# Altium project NEXUS_tapeout_connector.PrjPcb
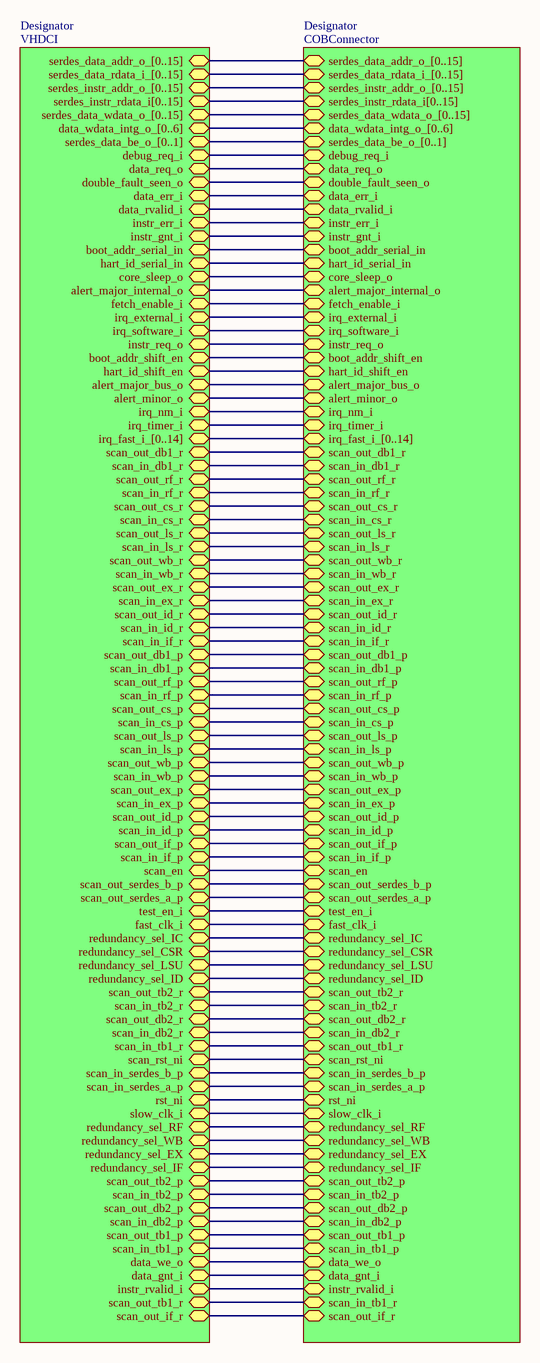
[diagram p0: Main.SchDoc]
3 sheets, 14 parts. Net scope: hierarchical (ports join the sheet entries above them; power ports are global).
Board file: PCB1.PcbDoc
Sheets:
  Main.SchDoc
    Designator = VHDCI.SchDoc
    Designator = COBConnector.SchDoc

## Sheet Main.SchDoc
size B portrait; SheetNumber: 1; SheetTotal: 3

### Sub-sheets
Designator = VHDCI: serdes_data_addr_o_[0..15] (bidir), serdes_data_rdata_i_[0..15] (bidir), serdes_instr_addr_o_[0..15] (bidir), serdes_instr_rdata_i[0..15] (bidir), serdes_data_wdata_o_[0..15] (bidir), data_wdata_intg_o_[0..6] (bidir), serdes_data_be_o_[0..1] (bidir), data_req_o (bidir), double_fault_seen_o (bidir), data_err_i (bidir), data_rvalid_i (bidir), instr_err_i (bidir), instr_gnt_i (bidir), boot_addr_serial_in (bidir), hart_id_serial_in (bidir), core_sleep_o (bidir), alert_major_internal_o (bidir), fetch_enable_i (bidir), irq_external_i (bidir), irq_software_i (bidir), instr_req_o (bidir), boot_addr_shift_en (bidir), hart_id_shift_en (bidir), alert_major_bus_o (bidir), alert_minor_o (bidir), irq_nm_i (bidir), irq_timer_i (bidir), irq_fast_i_[0..14] (bidir), scan_out_db1_r (bidir), scan_in_db1_r (bidir), scan_out_rf_r (bidir), scan_in_rf_r (bidir), scan_out_cs_r (bidir), scan_in_cs_r (bidir), scan_out_ls_r (bidir), scan_in_ls_r (bidir), scan_out_wb_r (bidir), scan_in_wb_r (bidir), scan_out_ex_r (bidir), scan_in_ex_r (bidir), scan_out_id_r (bidir), scan_in_id_r (bidir), scan_out_if_r (bidir), scan_in_if_r (bidir), scan_out_db1_p (bidir), scan_in_db1_p (bidir), scan_out_rf_p (bidir), scan_in_rf_p (bidir), scan_out_cs_p (bidir), scan_in_cs_p (bidir), scan_out_ls_p (bidir), scan_in_ls_p (bidir), scan_out_wb_p (bidir), scan_in_wb_p (bidir), scan_out_ex_p (bidir), scan_in_ex_p (bidir), scan_out_id_p (bidir), scan_in_id_p (bidir), scan_out_if_p (bidir), scan_in_if_p (bidir), scan_en (bidir), scan_out_serdes_b_p (bidir), scan_out_serdes_a_p (bidir), test_en_i (bidir), fast_clk_i (bidir), redundancy_sel_IC (bidir), redundancy_sel_CSR (bidir), redundancy_sel_LSU (bidir), redundancy_sel_ID (bidir), scan_out_tb2_r (bidir), scan_in_tb2_r (bidir), scan_out_db2_r (bidir), scan_in_db2_r (bidir), scan_in_tb1_r (bidir), scan_rst_ni (bidir), scan_in_serdes_b_p (bidir), scan_in_serdes_a_p (bidir), rst_ni (bidir), slow_clk_i (bidir), redundancy_sel_RF (bidir), redundancy_sel_WB (bidir), redundancy_sel_EX (bidir), redundancy_sel_IF (bidir), scan_out_tb2_p (bidir), scan_in_tb2_p (bidir), scan_out_db2_p (bidir), scan_in_db2_p (bidir), scan_out_tb1_p (bidir), scan_in_tb1_p (bidir), debug_req_i (bidir), data_we_o (bidir), data_gnt_i (bidir), instr_rvalid_i (bidir), scan_out_tb1_r (bidir)
Designator = COBConnector: serdes_data_addr_o_[0..15] (bidir), serdes_data_rdata_i_[0..15] (bidir), serdes_instr_addr_o_[0..15] (bidir), serdes_data_wdata_o_[0..15] (bidir), data_wdata_intg_o_[0..6] (bidir), serdes_data_be_o_[0..1] (bidir), debug_req_i (bidir), data_req_o (bidir), double_fault_seen_o (bidir), data_err_i (bidir), data_rvalid_i (bidir), data_we_o (bidir), data_gnt_i (bidir), instr_err_i (bidir), instr_gnt_i (bidir), boot_addr_serial_in (bidir), hart_id_serial_in (bidir), core_sleep_o (bidir), alert_major_internal_o (bidir), fetch_enable_i (bidir), irq_external_i (bidir), irq_software_i (bidir), instr_req_o (bidir), boot_addr_shift_en (bidir), hart_id_shift_en (bidir), alert_major_bus_o (bidir), alert_minor_o (bidir), irq_nm_i (bidir), irq_timer_i (bidir), irq_fast_i_[0..14] (bidir), scan_out_db1_r (bidir), scan_in_db1_r (bidir), scan_out_rf_r (bidir), scan_in_rf_r (bidir), scan_out_cs_r (bidir), scan_in_cs_r (bidir), scan_out_ls_r (bidir), scan_in_ls_r (bidir), scan_out_wb_r (bidir), scan_in_wb_r (bidir), scan_out_ex_r (bidir), scan_in_ex_r (bidir), scan_out_id_r (bidir), scan_out_if_r (bidir), scan_in_if_r (bidir), scan_out_db1_p (bidir), scan_in_db1_p (bidir), scan_out_rf_p (bidir), scan_in_rf_p (bidir), scan_out_cs_p (bidir), scan_in_cs_p (bidir), scan_out_ls_p (bidir), scan_in_ls_p (bidir), scan_out_wb_p (bidir), scan_in_wb_p (bidir), scan_out_ex_p (bidir), scan_in_ex_p (bidir), scan_out_id_p (bidir), scan_in_id_p (bidir), scan_out_if_p (bidir), scan_in_if_p (bidir), scan_en (bidir), scan_out_serdes_b_p (bidir), scan_out_serdes_a_p (bidir), test_en_i (bidir), fast_clk_i (bidir), redundancy_sel_IC (bidir), redundancy_sel_CSR (bidir), redundancy_sel_LSU (bidir), redundancy_sel_ID (bidir), scan_out_tb2_r (bidir), scan_in_tb2_r (bidir), scan_out_db2_r (bidir), scan_in_db2_r (bidir), scan_out_tb1_r (bidir), scan_rst_ni (bidir), scan_in_serdes_b_p (bidir), scan_in_serdes_a_p (bidir), rst_ni (bidir), slow_clk_i (bidir), redundancy_sel_RF (bidir), redundancy_sel_WB (bidir), redundancy_sel_EX (bidir), redundancy_sel_IF (bidir), scan_out_tb2_p (bidir), scan_in_tb2_p (bidir), scan_out_db2_p (bidir), scan_in_db2_p (bidir), scan_out_tb1_p (bidir), scan_in_tb1_p (bidir), scan_in_id_r (bidir), serdes_instr_rdata_i[0..15] (bidir), instr_rvalid_i (bidir), scan_in_tb1_r (bidir)

### Nets
alert_major_bus_o: sheet Designator/alert_major_bus_o, sheet Designator/alert_major_bus_o
alert_major_internal_o: sheet Designator/alert_major_internal_o, sheet Designator/alert_major_internal_o
alert_minor_o: sheet Designator/alert_minor_o, sheet Designator/alert_minor_o
boot_addr_serial_in: sheet Designator/boot_addr_serial_in, sheet Designator/boot_addr_serial_in
boot_addr_shift_en: sheet Designator/boot_addr_shift_en, sheet Designator/boot_addr_shift_en
core_sleep_o: sheet Designator/core_sleep_o, sheet Designator/core_sleep_o
data_err_i: sheet Designator/data_err_i, sheet Designator/data_err_i
data_gnt_i: sheet Designator/data_gnt_i, sheet Designator/data_gnt_i
data_req_o: sheet Designator/data_req_o, sheet Designator/data_req_o
data_rvalid_i: sheet Designator/data_rvalid_i, sheet Designator/data_rvalid_i
data_we_o: sheet Designator/data_we_o, sheet Designator/data_we_o
debug_req_i: sheet Designator/debug_req_i, sheet Designator/debug_req_i
double_fault_seen_o: sheet Designator/double_fault_seen_o, sheet Designator/double_fault_seen_o
fast_clk_i: sheet Designator/fast_clk_i, sheet Designator/fast_clk_i
fetch_enable_i: sheet Designator/fetch_enable_i, sheet Designator/fetch_enable_i
hard_id_serial_in: sheet Designator/hart_id_serial_in, sheet Designator/hart_id_serial_in
hard_id_shift_en: sheet Designator/hart_id_shift_en, sheet Designator/hart_id_shift_en
instr_err_i: sheet Designator/instr_err_i, sheet Designator/instr_err_i
instr_gnt_i: sheet Designator/instr_gnt_i, sheet Designator/instr_gnt_i
instr_req_o: sheet Designator/instr_req_o, sheet Designator/instr_req_o
instr_rvalid_i: sheet Designator/instr_rvalid_i, sheet Designator/instr_rvalid_i
irq_external_i: sheet Designator/irq_external_i, sheet Designator/irq_external_i
irq_nm_i: sheet Designator/irq_nm_i, sheet Designator/irq_nm_i
irq_software_i: sheet Designator/irq_software_i, sheet Designator/irq_software_i
irq_timer_i: sheet Designator/irq_timer_i, sheet Designator/irq_timer_i
redundancy_sel_CSR: sheet Designator/redundancy_sel_CSR, sheet Designator/redundancy_sel_CSR
redundancy_sel_EX: sheet Designator/redundancy_sel_EX, sheet Designator/redundancy_sel_EX
redundancy_sel_IC: sheet Designator/redundancy_sel_IC, sheet Designator/redundancy_sel_IC
redundancy_sel_ID: sheet Designator/redundancy_sel_ID, sheet Designator/redundancy_sel_ID
redundancy_sel_IF: sheet Designator/redundancy_sel_IF, sheet Designator/redundancy_sel_IF
redundancy_sel_LSU: sheet Designator/redundancy_sel_LSU, sheet Designator/redundancy_sel_LSU
redundancy_sel_RF: sheet Designator/redundancy_sel_RF, sheet Designator/redundancy_sel_RF
redundancy_sel_WB: sheet Designator/redundancy_sel_WB, sheet Designator/redundancy_sel_WB
rst_ni: sheet Designator/rst_ni, sheet Designator/rst_ni
scan_en: sheet Designator/scan_en, sheet Designator/scan_en
scan_in_cs_p: sheet Designator/scan_in_cs_p, sheet Designator/scan_in_cs_p
scan_in_cs_r: sheet Designator/scan_in_cs_r, sheet Designator/scan_in_cs_r
scan_in_db1_p: sheet Designator/scan_in_db1_p, sheet Designator/scan_in_db1_p
scan_in_db1_r: sheet Designator/scan_in_db1_r, sheet Designator/scan_in_db1_r
scan_in_db2_p: sheet Designator/scan_in_db2_p, sheet Designator/scan_in_db2_p
scan_in_db2_r: sheet Designator/scan_in_db2_r, sheet Designator/scan_in_db2_r
scan_in_ex_p: sheet Designator/scan_in_ex_p, sheet Designator/scan_in_ex_p
scan_in_ex_r: sheet Designator/scan_in_ex_r, sheet Designator/scan_in_ex_r
scan_in_id_p: sheet Designator/scan_in_id_p, sheet Designator/scan_in_id_p
scan_in_id_r: sheet Designator/scan_in_id_r, sheet Designator/scan_in_id_r
scan_in_if_p: sheet Designator/scan_in_if_p, sheet Designator/scan_in_if_p
scan_in_if_r: sheet Designator/scan_in_if_r, sheet Designator/scan_in_if_r
scan_in_ls_p: sheet Designator/scan_in_ls_p, sheet Designator/scan_in_ls_p
scan_in_ls_r: sheet Designator/scan_in_ls_r, sheet Designator/scan_in_ls_r
scan_in_rf_p: sheet Designator/scan_in_rf_p, sheet Designator/scan_in_rf_p
scan_in_rf_r: sheet Designator/scan_in_rf_r, sheet Designator/scan_in_rf_r
scan_in_serdes_a_p: sheet Designator/scan_in_serdes_a_p, sheet Designator/scan_in_serdes_a_p
scan_in_serdes_b_p: sheet Designator/scan_in_serdes_b_p, sheet Designator/scan_in_serdes_b_p
scan_in_tb1_p: sheet Designator/scan_in_tb1_p, sheet Designator/scan_in_tb1_p
scan_in_tb1_r: sheet Designator/scan_out_tb1_r, sheet Designator/scan_in_tb1_r
scan_in_tb1_r: sheet Designator/scan_in_tb1_r, sheet Designator/scan_out_tb1_r  [a separate net that carries the same name]
scan_in_tb2_p: sheet Designator/scan_in_tb2_p, sheet Designator/scan_in_tb2_p
scan_in_tb2_r: sheet Designator/scan_in_tb2_r, sheet Designator/scan_in_tb2_r
scan_in_wb_p: sheet Designator/scan_in_wb_p, sheet Designator/scan_in_wb_p
scan_in_wb_r: sheet Designator/scan_in_wb_r, sheet Designator/scan_in_wb_r
scan_out_cs_p: sheet Designator/scan_out_cs_p, sheet Designator/scan_out_cs_p
scan_out_cs_r: sheet Designator/scan_out_cs_r, sheet Designator/scan_out_cs_r
scan_out_db1_p: sheet Designator/scan_out_db1_p, sheet Designator/scan_out_db1_p
scan_out_db1_r: sheet Designator/scan_out_db1_r, sheet Designator/scan_out_db1_r
scan_out_db2_p: sheet Designator/scan_out_db2_p, sheet Designator/scan_out_db2_p
scan_out_db2_r: sheet Designator/scan_out_db2_r, sheet Designator/scan_out_db2_r
scan_out_ex_p: sheet Designator/scan_out_ex_p, sheet Designator/scan_out_ex_p
scan_out_ex_r: sheet Designator/scan_out_ex_r, sheet Designator/scan_out_ex_r
scan_out_id_p: sheet Designator/scan_out_id_p, sheet Designator/scan_out_id_p
scan_out_id_r: sheet Designator/scan_out_id_r, sheet Designator/scan_out_id_r
scan_out_if_p: sheet Designator/scan_out_if_p, sheet Designator/scan_out_if_p
scan_out_if_r: sheet Designator/scan_out_if_r, sheet Designator/scan_out_if_r
scan_out_ls_p: sheet Designator/scan_out_ls_p, sheet Designator/scan_out_ls_p
scan_out_ls_r: sheet Designator/scan_out_ls_r, sheet Designator/scan_out_ls_r
scan_out_rf_p: sheet Designator/scan_out_rf_p, sheet Designator/scan_out_rf_p
scan_out_rf_r: sheet Designator/scan_out_rf_r, sheet Designator/scan_out_rf_r
scan_out_serdes_a_p: sheet Designator/scan_out_serdes_a_p, sheet Designator/scan_out_serdes_a_p
scan_out_serdes_b_p: sheet Designator/scan_out_serdes_b_p, sheet Designator/scan_out_serdes_b_p
scan_out_tb1_p: sheet Designator/scan_out_tb1_p, sheet Designator/scan_out_tb1_p
scan_out_tb2_p: sheet Designator/scan_out_tb2_p, sheet Designator/scan_out_tb2_p
scan_out_tb2_r: sheet Designator/scan_out_tb2_r, sheet Designator/scan_out_tb2_r
scan_out_wb_p: sheet Designator/scan_out_wb_p, sheet Designator/scan_out_wb_p
scan_out_wb_r: sheet Designator/scan_out_wb_r, sheet Designator/scan_out_wb_r
scan_rst_ni: sheet Designator/scan_rst_ni, sheet Designator/scan_rst_ni
slow_clk_i: sheet Designator/slow_clk_i, sheet Designator/slow_clk_i
test_en_i: sheet Designator/test_en_i, sheet Designator/test_en_i
(unnamed): sheet Designator/irq_fast_i_[0..14], sheet Designator/irq_fast_i_[0..14]

## Sheet VHDCI.SchDoc
size C; SheetNumber: 3; SheetTotal: 3
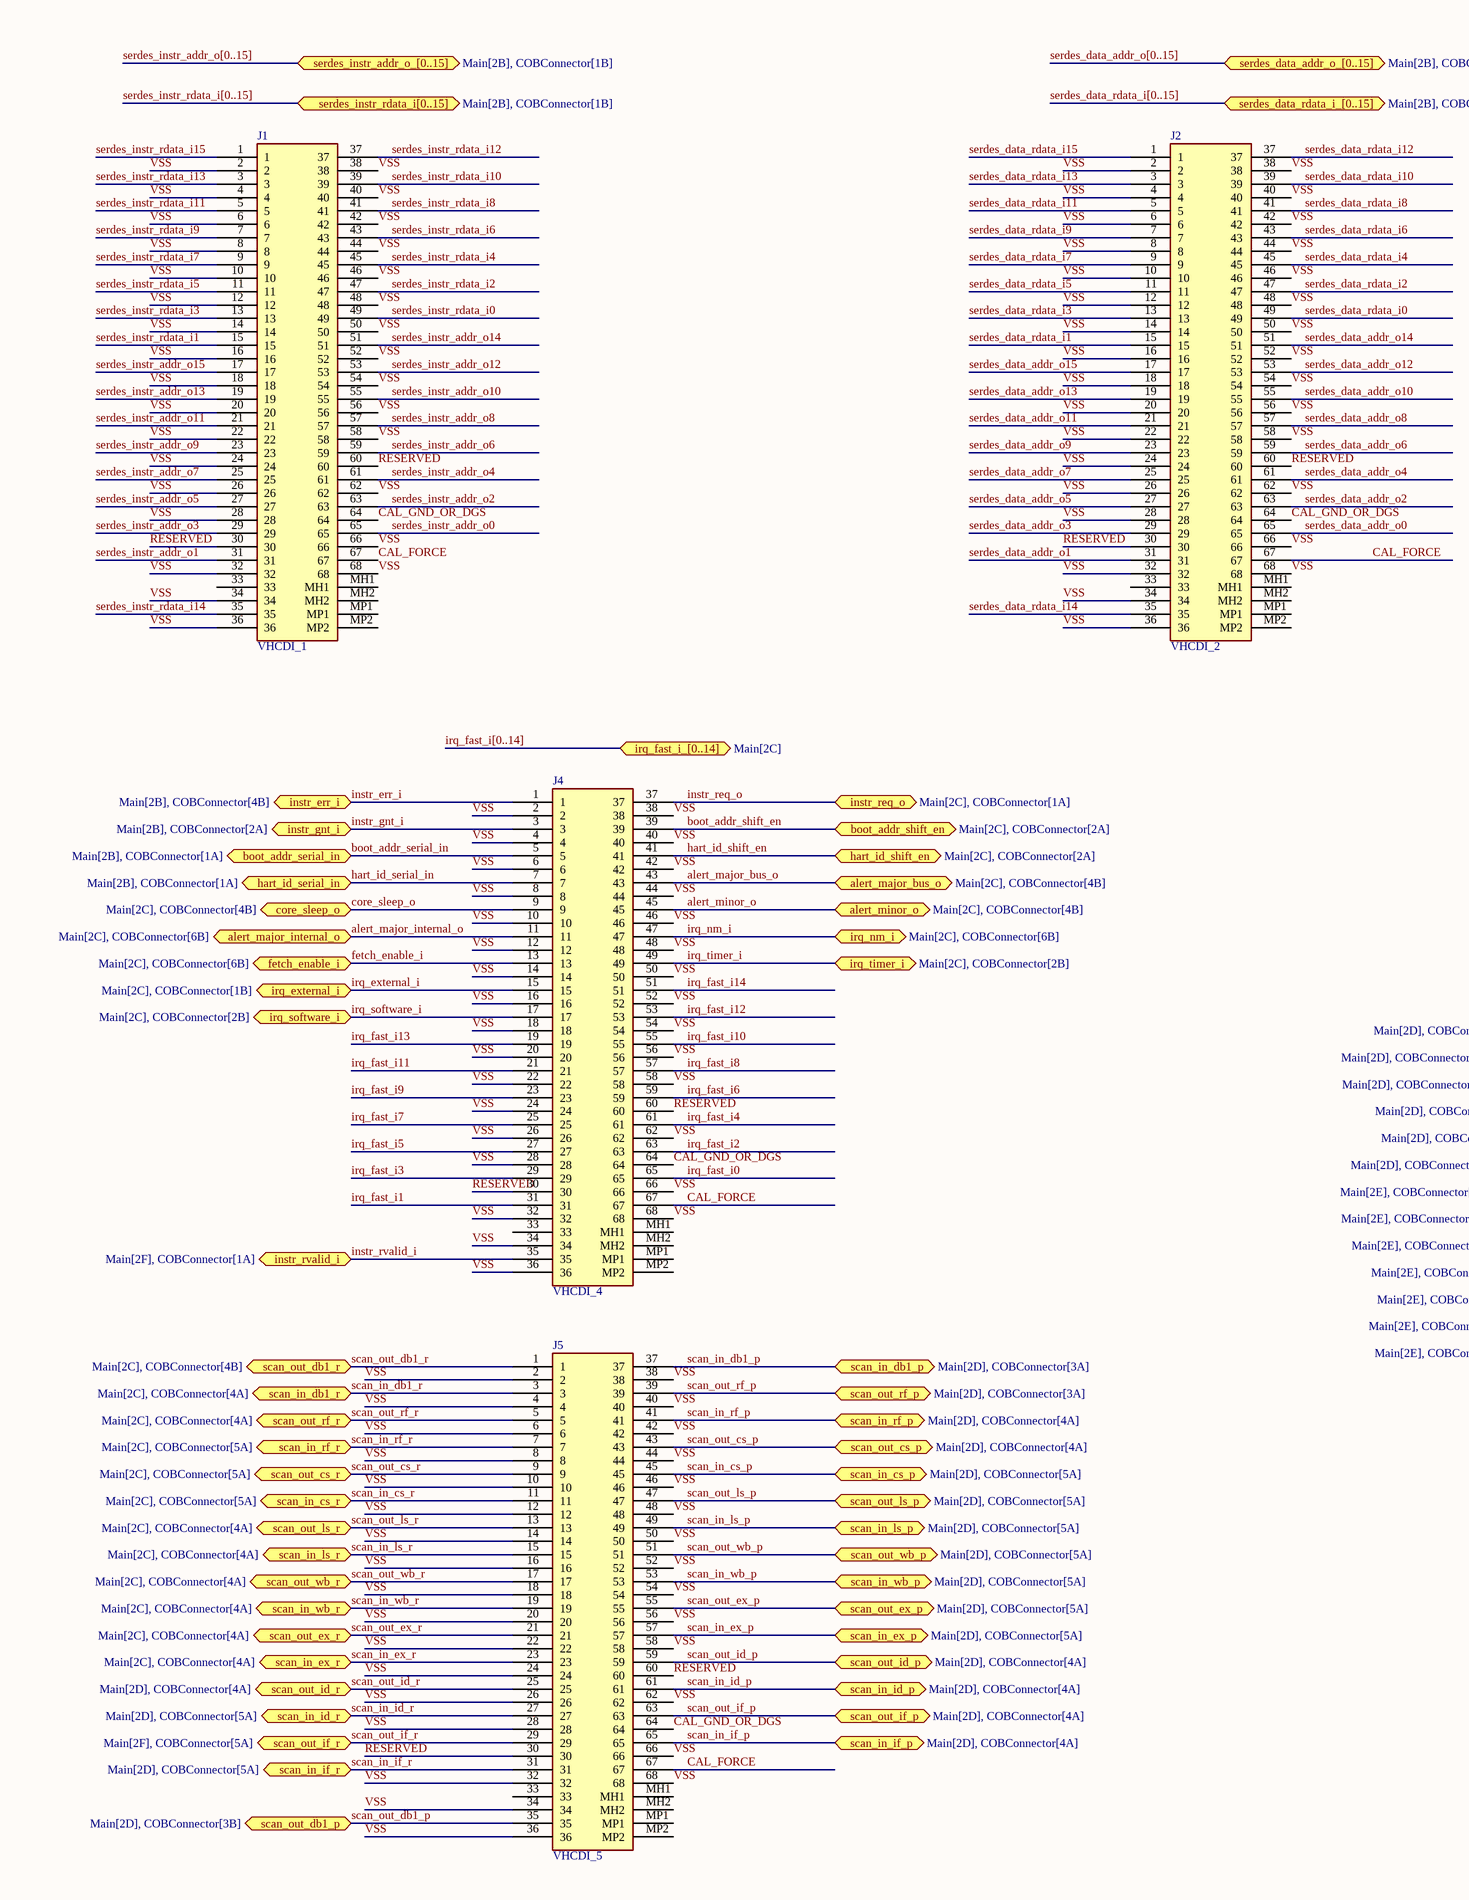
[diagram p1: VHDCI.SchDoc, left]
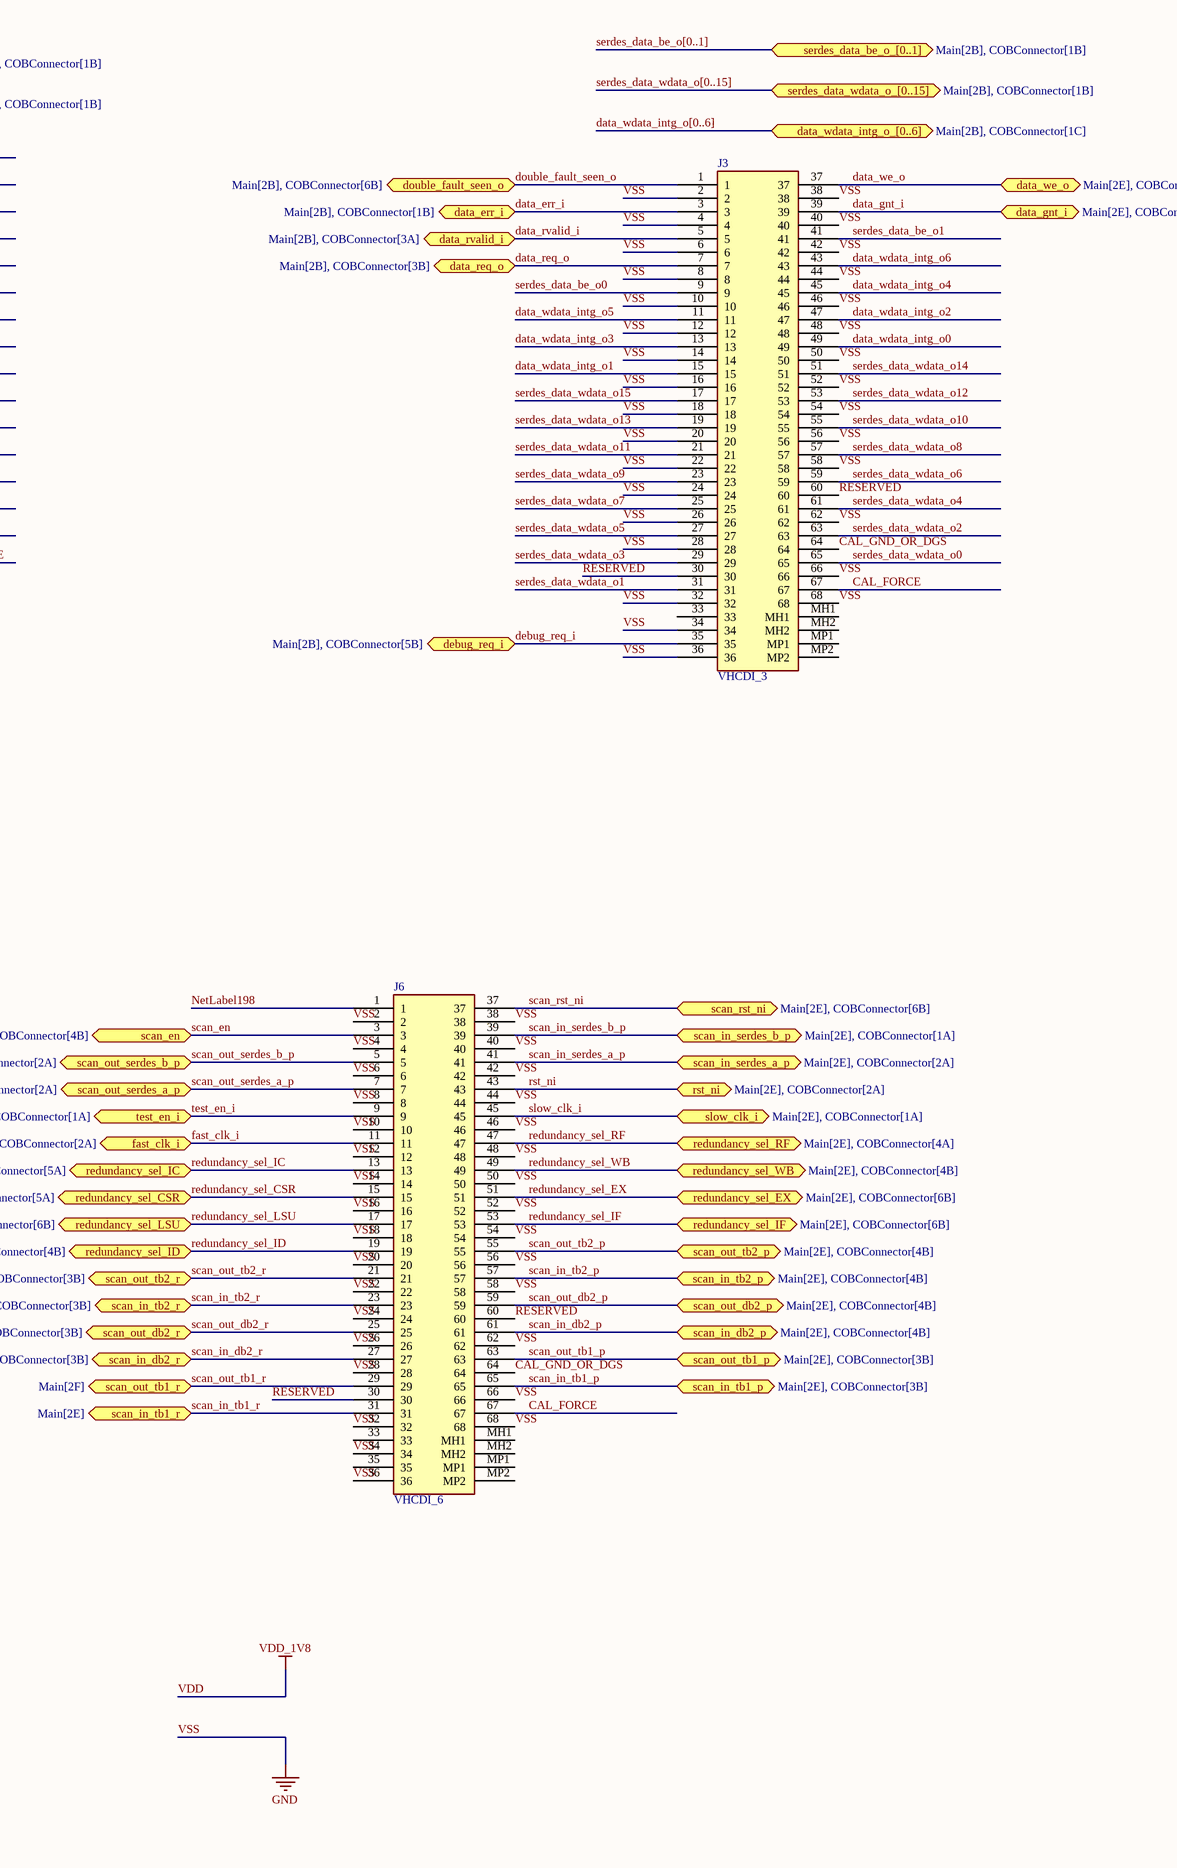
[diagram p2: VHDCI.SchDoc, right]

### Parts
J1  VHCDI_1  [CONN68_HDRA-EC_HON]
J2  VHCDI_2  [CONN68_HDRA-EC_HON]
J3  VHCDI_3  [CONN68_HDRA-EC_HON]
J4  VHCDI_4  [CONN68_HDRA-EC_HON]
J5  VHCDI_5  [CONN68_HDRA-EC_HON]
J6  VHCDI_6  [CONN68_HDRA-EC_HON]

### Ports
alert_major_bus_o (bidir, see Main[2C], COBConnector[4B]), alert_major_internal_o (bidir, see Main[2C], COBConnector[6B]), alert_minor_o (bidir, see Main[2C], COBConnector[4B]), boot_addr_serial_in (bidir, see Main[2B], COBConnector[1A]), boot_addr_shift_en (bidir, see Main[2C], COBConnector[2A]), core_sleep_o (bidir, see Main[2C], COBConnector[4B]), data_err_i (bidir, see Main[2B], COBConnector[1B]), data_gnt_i (bidir, see Main[2E], COBConnector[4A]), data_req_o (bidir, see Main[2B], COBConnector[3B]), data_rvalid_i (bidir, see Main[2B], COBConnector[3A]), data_wdata_intg_o_[0..6] (bidir, see Main[2B], COBConnector[1C]), data_we_o (bidir, see Main[2E], COBConnector[4A]), debug_req_i (bidir, see Main[2B], COBConnector[5B]), double_fault_seen_o (bidir, see Main[2B], COBConnector[6B]), fast_clk_i (bidir, see Main[2D], COBConnector[2A]), fetch_enable_i (bidir, see Main[2C], COBConnector[6B]), hart_id_serial_in (bidir, see Main[2B], COBConnector[1A]), hart_id_shift_en (bidir, see Main[2C], COBConnector[2A]), instr_err_i (bidir, see Main[2B], COBConnector[4B]), instr_gnt_i (bidir, see Main[2B], COBConnector[2A]), instr_req_o (bidir, see Main[2C], COBConnector[1A]), instr_rvalid_i (bidir, see Main[2F], COBConnector[1A]), irq_external_i (bidir, see Main[2C], COBConnector[1B]), irq_fast_i_[0..14] (bidir, see Main[2C]), irq_nm_i (bidir, see Main[2C], COBConnector[6B]), irq_software_i (bidir, see Main[2C], COBConnector[2B]), irq_timer_i (bidir, see Main[2C], COBConnector[2B]), redundancy_sel_CSR (bidir, see Main[2E], COBConnector[5A]), redundancy_sel_EX (bidir, see Main[2E], COBConnector[6B]), redundancy_sel_IC (bidir, see Main[2D], COBConnector[5A]), redundancy_sel_ID (bidir, see Main[2E], COBConnector[4B]), redundancy_sel_IF (bidir, see Main[2E], COBConnector[6B]), redundancy_sel_LSU (bidir, see Main[2E], COBConnector[6B]), redundancy_sel_RF (bidir, see Main[2E], COBConnector[4A]), redundancy_sel_WB (bidir, see Main[2E], COBConnector[4B]), rst_ni (bidir, see Main[2E], COBConnector[2A]), scan_en (bidir, see Main[2D], COBConnector[4B]), scan_in_cs_p (bidir, see Main[2D], COBConnector[5A]), scan_in_cs_r (bidir, see Main[2C], COBConnector[5A]), scan_in_db1_p (bidir, see Main[2D], COBConnector[3A]), scan_in_db1_r (bidir, see Main[2C], COBConnector[4A]), scan_in_db2_p (bidir, see Main[2E], COBConnector[4B]), scan_in_db2_r (bidir, see Main[2E], COBConnector[3B]), scan_in_ex_p (bidir, see Main[2D], COBConnector[5A]), scan_in_ex_r (bidir, see Main[2C], COBConnector[4A]), scan_in_id_p (bidir, see Main[2D], COBConnector[4A]), scan_in_id_r (bidir, see Main[2D], COBConnector[5A]), scan_in_if_p (bidir, see Main[2D], COBConnector[4A]), scan_in_if_r (bidir, see Main[2D], COBConnector[5A]), scan_in_ls_p (bidir, see Main[2D], COBConnector[5A]), scan_in_ls_r (bidir, see Main[2C], COBConnector[4A]), scan_in_rf_p (bidir, see Main[2D], COBConnector[4A]), scan_in_rf_r (bidir, see Main[2C], COBConnector[5A]), scan_in_serdes_a_p (bidir, see Main[2E], COBConnector[2A]), scan_in_serdes_b_p (bidir, see Main[2E], COBConnector[1A]), scan_in_tb1_p (bidir, see Main[2E], COBConnector[3B]), scan_in_tb1_r (bidir, see Main[2E]), scan_in_tb2_p (bidir, see Main[2E], COBConnector[4B]), scan_in_tb2_r (bidir, see Main[2E], COBConnector[3B]), scan_in_wb_p (bidir, see Main[2D], COBConnector[5A]), scan_in_wb_r (bidir, see Main[2C], COBConnector[4A]), scan_out_cs_p (bidir, see Main[2D], COBConnector[4A]), scan_out_cs_r (bidir, see Main[2C], COBConnector[5A]), scan_out_db1_p (bidir, see Main[2D], COBConnector[3B]), scan_out_db1_r (bidir, see Main[2C], COBConnector[4B]), scan_out_db2_p (bidir, see Main[2E], COBConnector[4B]), scan_out_db2_r (bidir, see Main[2E], COBConnector[3B]), scan_out_ex_p (bidir, see Main[2D], COBConnector[5A]), scan_out_ex_r (bidir, see Main[2C], COBConnector[4A]), scan_out_id_p (bidir, see Main[2D], COBConnector[4A]), scan_out_id_r (bidir, see Main[2D], COBConnector[4A]), scan_out_if_p (bidir, see Main[2D], COBConnector[4A]), scan_out_if_r (bidir, see Main[2F], COBConnector[5A]), scan_out_ls_p (bidir, see Main[2D], COBConnector[5A]), scan_out_ls_r (bidir, see Main[2C], COBConnector[4A]), scan_out_rf_p (bidir, see Main[2D], COBConnector[3A]), scan_out_rf_r (bidir, see Main[2C], COBConnector[4A]), scan_out_serdes_a_p (bidir, see Main[2D], COBConnector[2A]), scan_out_serdes_b_p (bidir, see Main[2D], COBConnector[2A]), scan_out_tb1_p (bidir, see Main[2E], COBConnector[3B]), scan_out_tb1_r (bidir, see Main[2F]), scan_out_tb2_p (bidir, see Main[2E], COBConnector[4B]), scan_out_tb2_r (bidir, see Main[2E], COBConnector[3B]), scan_out_wb_p (bidir, see Main[2D], COBConnector[5A]), scan_out_wb_r (bidir, see Main[2C], COBConnector[4A]), scan_rst_ni (bidir, see Main[2E], COBConnector[6B]), serdes_data_addr_o_[0..15] (bidir, see Main[2B], COBConnector[1B]), serdes_data_be_o_[0..1] (bidir, see Main[2B], COBConnector[1B]), serdes_data_rdata_i_[0..15] (bidir, see Main[2B], COBConnector[1B]), serdes_data_wdata_o_[0..15] (bidir, see Main[2B], COBConnector[1B]), serdes_instr_addr_o_[0..15] (bidir, see Main[2B], COBConnector[1B]), serdes_instr_rdata_i[0..15] (bidir, see Main[2B], COBConnector[1B]), slow_clk_i (bidir, see Main[2E], COBConnector[1A]), test_en_i (bidir, see Main[2D], COBConnector[1A])

### Nets
VSS: J1.2 J1.4 J1.6 J1.8 J1.10 J1.12 J1.14 J1.16 J1.18 J1.20 J1.22 J1.24 J1.26 J1.28 J1.32 J1.34 J1.36 J1.38 J1.40 J1.42 J1.44 J1.46 J1.48 J1.50 J1.52 J1.54 J1.56 J1.58 J1.62 J1.66 J1.68 J2.2 J2.4 J2.6 J2.8 J2.10 J2.12 J2.14 J2.16 J2.18 J2.20 J2.22 J2.24 J2.26 J2.28 J2.32 J2.34 J2.36 J2.38 J2.40 J2.42 J2.44 J2.46 J2.48 J2.50 J2.52 J2.54 J2.56 J2.58 J2.62 J2.66 J2.68 J3.2 J3.4 J3.6 J3.8 J3.10 J3.12 J3.14 J3.16 J3.18 J3.20 J3.22 J3.24 J3.26 J3.28 J3.32 J3.34 J3.36 J3.38 J3.40 J3.42 J3.44 J3.46 J3.48 J3.50 J3.52 J3.54 J3.56 J3.58 J3.62 J3.66 J3.68 J4.2 J4.4 J4.6 J4.8 J4.10 J4.12 J4.14 J4.16 J4.18 J4.20 J4.22 J4.24 J4.26 J4.28 J4.32 J4.34 J4.36 J4.38 J4.40 J4.42 J4.44 J4.46 J4.48 J4.50 J4.52 J4.54 J4.56 J4.58 J4.62 J4.66 J4.68 J5.2 J5.4 J5.6 J5.8 J5.10 J5.12 J5.14 J5.16 J5.18 J5.20 J5.22 J5.24 J5.26 J5.28 J5.32 J5.34 J5.36 J5.38 J5.40 J5.42 J5.44 J5.46 J5.48 J5.50 J5.52 J5.54 J5.56 J5.58 J5.62 J5.66 J5.68 J6.2 J6.4 J6.6 J6.8 J6.10 J6.12 J6.14 J6.16 J6.18 J6.20 J6.22 J6.24 J6.26 J6.28 J6.32 J6.34 J6.36 J6.38 J6.40 J6.42 J6.44 J6.46 J6.48 J6.50 J6.52 J6.54 J6.56 J6.58 J6.62 J6.66 J6.68  [also labelled GND]
alert_major_bus_o: J4.43 ; port alert_major_bus_o
alert_major_internal_o: J4.11 ; port alert_major_internal_o
alert_minor_o: J4.45 ; port alert_minor_o
boot_addr_serial_in: J4.5 ; port boot_addr_serial_in
boot_addr_shift_en: J4.39 ; port boot_addr_shift_en
CAL_FORCE: J1.67 J2.67 J3.67 J4.67 J5.67 J6.67
CAL_GND_OR_DGS: J1.64 J2.64 J3.64 J4.64 J5.64 J6.64
core_sleep_o: J4.9 ; port core_sleep_o
data_err_i: J3.3 ; port data_err_i
data_gnt_i: J3.39 ; port data_gnt_i
data_req_o: J3.7 ; port data_req_o
data_rvalid_i: J3.5 ; port data_rvalid_i
data_wdata_intg_o0: J3.49  [project net data_wdata_integ_o0]
data_wdata_intg_o1: J3.15  [project net data_wdata_integ_o1]
data_wdata_intg_o2: J3.47  [project net data_wdata_integ_o2]
data_wdata_intg_o3: J3.13  [project net data_wdata_integ_o3]
data_wdata_intg_o4: J3.45  [project net data_wdata_integ_o4]
data_wdata_intg_o5: J3.11  [project net data_wdata_integ_o5]
data_wdata_intg_o6: J3.43  [project net data_wdata_integ_o6]
data_we_o: J3.37 ; port data_we_o
debug_req_i: J3.35 ; port debug_req_i
double_fault_seen_o: J3.1 ; port double_fault_seen_o
fast_clk_i: J6.11 ; port fast_clk_i
fetch_enable_i: J4.13 ; port fetch_enable_i
hart_id_serial_in: J4.7 ; port hart_id_serial_in  [project net hard_id_serial_in]
hart_id_shift_en: J4.41 ; port hart_id_shift_en  [project net hard_id_shift_en]
instr_err_i: J4.1 ; port instr_err_i
instr_gnt_i: J4.3 ; port instr_gnt_i
instr_req_o: J4.37 ; port instr_req_o
instr_rvalid_i: J4.35 ; port instr_rvalid_i
irq_external_i: J4.15 ; port irq_external_i
irq_fast_i0: J4.65
irq_fast_i1: J4.31
irq_fast_i2: J4.63
irq_fast_i3: J4.29
irq_fast_i4: J4.61
irq_fast_i5: J4.27
irq_fast_i6: J4.59
irq_fast_i7: J4.25
irq_fast_i8: J4.57
irq_fast_i9: J4.23
irq_fast_i10: J4.55
irq_fast_i11: J4.21
irq_fast_i12: J4.53
irq_fast_i13: J4.19
irq_fast_i14: J4.51
irq_nm_i: J4.47 ; port irq_nm_i
irq_software_i: J4.17 ; port irq_software_i
irq_timer_i: J4.49 ; port irq_timer_i
NetLabel198: J6.1
redundancy_sel_CSR: J6.15 ; port redundancy_sel_CSR
redundancy_sel_EX: J6.51 ; port redundancy_sel_EX
redundancy_sel_IC: J6.13 ; port redundancy_sel_IC
redundancy_sel_ID: J6.19 ; port redundancy_sel_ID
redundancy_sel_IF: J6.53 ; port redundancy_sel_IF
redundancy_sel_LSU: J6.17 ; port redundancy_sel_LSU
redundancy_sel_RF: J6.47 ; port redundancy_sel_RF
redundancy_sel_WB: J6.49 ; port redundancy_sel_WB
RESERVED: J1.30 J1.60 J2.30 J2.60 J3.30 J3.60 J4.30 J4.60 J5.30 J5.60 J6.30 J6.60
rst_ni: J6.43 ; port rst_ni
scan_en: J6.3 ; port scan_en
scan_in_cs_p: J5.45 ; port scan_in_cs_p
scan_in_cs_r: J5.11 ; port scan_in_cs_r
scan_in_db1_p: J5.37 ; port scan_in_db1_p
scan_in_db1_r: J5.3 ; port scan_in_db1_r
scan_in_db2_p: J6.61 ; port scan_in_db2_p
scan_in_db2_r: J6.27 ; port scan_in_db2_r
scan_in_ex_p: J5.57 ; port scan_in_ex_p
scan_in_ex_r: J5.23 ; port scan_in_ex_r
scan_in_id_p: J5.61 ; port scan_in_id_p
scan_in_id_r: J5.27 ; port scan_in_id_r
scan_in_if_p: J5.65 ; port scan_in_if_p
scan_in_if_r: J5.31 ; port scan_in_if_r
scan_in_ls_p: J5.49 ; port scan_in_ls_p
scan_in_ls_r: J5.15 ; port scan_in_ls_r
scan_in_rf_p: J5.41 ; port scan_in_rf_p
scan_in_rf_r: J5.7 ; port scan_in_rf_r
scan_in_serdes_a_p: J6.41 ; port scan_in_serdes_a_p
scan_in_serdes_b_p: J6.39 ; port scan_in_serdes_b_p
scan_in_tb1_p: J6.65 ; port scan_in_tb1_p
scan_in_tb1_r: J6.31 ; port scan_in_tb1_r
scan_in_tb2_p: J6.57 ; port scan_in_tb2_p
scan_in_tb2_r: J6.23 ; port scan_in_tb2_r
scan_in_wb_p: J5.53 ; port scan_in_wb_p
scan_in_wb_r: J5.19 ; port scan_in_wb_r
scan_out_cs_p: J5.43 ; port scan_out_cs_p
scan_out_cs_r: J5.9 ; port scan_out_cs_r
scan_out_db1_p: J5.35 ; port scan_out_db1_p
scan_out_db1_r: J5.1 ; port scan_out_db1_r
scan_out_db2_p: J6.59 ; port scan_out_db2_p
scan_out_db2_r: J6.25 ; port scan_out_db2_r
scan_out_ex_p: J5.55 ; port scan_out_ex_p
scan_out_ex_r: J5.21 ; port scan_out_ex_r
scan_out_id_p: J5.59 ; port scan_out_id_p
scan_out_id_r: J5.25 ; port scan_out_id_r
scan_out_if_p: J5.63 ; port scan_out_if_p
scan_out_if_r: J5.29 ; port scan_out_if_r
scan_out_ls_p: J5.47 ; port scan_out_ls_p
scan_out_ls_r: J5.13 ; port scan_out_ls_r
scan_out_rf_p: J5.39 ; port scan_out_rf_p
scan_out_rf_r: J5.5 ; port scan_out_rf_r
scan_out_serdes_a_p: J6.7 ; port scan_out_serdes_a_p
scan_out_serdes_b_p: J6.5 ; port scan_out_serdes_b_p
scan_out_tb1_p: J6.63 ; port scan_out_tb1_p
scan_out_tb1_r: J6.29 ; port scan_out_tb1_r  [project net scan_in_tb1_r]
scan_out_tb2_p: J6.55 ; port scan_out_tb2_p
scan_out_tb2_r: J6.21 ; port scan_out_tb2_r
scan_out_wb_p: J5.51 ; port scan_out_wb_p
scan_out_wb_r: J5.17 ; port scan_out_wb_r
scan_rst_ni: J6.37 ; port scan_rst_ni
serdes_data_addr_o0: J2.65
serdes_data_addr_o1: J2.31
serdes_data_addr_o2: J2.63
serdes_data_addr_o3: J2.29
serdes_data_addr_o4: J2.61
serdes_data_addr_o5: J2.27
serdes_data_addr_o6: J2.59
serdes_data_addr_o7: J2.25
serdes_data_addr_o8: J2.57
serdes_data_addr_o9: J2.23
serdes_data_addr_o10: J2.55
serdes_data_addr_o11: J2.21
serdes_data_addr_o12: J2.53
serdes_data_addr_o13: J2.19
serdes_data_addr_o14: J2.51
serdes_data_addr_o15: J2.17
serdes_data_be_o0: J3.9
serdes_data_be_o1: J3.41
serdes_data_rdata_i0: J2.49
serdes_data_rdata_i1: J2.15
serdes_data_rdata_i2: J2.47
serdes_data_rdata_i3: J2.13
serdes_data_rdata_i4: J2.45
serdes_data_rdata_i5: J2.11
serdes_data_rdata_i6: J2.43
serdes_data_rdata_i7: J2.9
serdes_data_rdata_i8: J2.41
serdes_data_rdata_i9: J2.7
serdes_data_rdata_i10: J2.39
serdes_data_rdata_i11: J2.5
serdes_data_rdata_i12: J2.37
serdes_data_rdata_i13: J2.3
serdes_data_rdata_i14: J2.35
serdes_data_rdata_i15: J2.1
serdes_data_wdata_o0: J3.65
serdes_data_wdata_o1: J3.31
serdes_data_wdata_o2: J3.63
serdes_data_wdata_o3: J3.29
serdes_data_wdata_o4: J3.61
serdes_data_wdata_o5: J3.27
serdes_data_wdata_o6: J3.59
serdes_data_wdata_o7: J3.25
serdes_data_wdata_o8: J3.57
serdes_data_wdata_o9: J3.23
serdes_data_wdata_o10: J3.55
serdes_data_wdata_o11: J3.21
serdes_data_wdata_o12: J3.53
serdes_data_wdata_o13: J3.19
serdes_data_wdata_o14: J3.51
serdes_data_wdata_o15: J3.17
serdes_instr_addr_o0: J1.65
serdes_instr_addr_o1: J1.31
serdes_instr_addr_o2: J1.63
serdes_instr_addr_o3: J1.29
serdes_instr_addr_o4: J1.61
serdes_instr_addr_o5: J1.27
serdes_instr_addr_o6: J1.59
serdes_instr_addr_o7: J1.25
serdes_instr_addr_o8: J1.57
serdes_instr_addr_o9: J1.23
serdes_instr_addr_o10: J1.55
serdes_instr_addr_o11: J1.21
serdes_instr_addr_o12: J1.53
serdes_instr_addr_o13: J1.19
serdes_instr_addr_o14: J1.51
serdes_instr_addr_o15: J1.17
serdes_instr_rdata_i0: J1.49
serdes_instr_rdata_i1: J1.15
serdes_instr_rdata_i2: J1.47
serdes_instr_rdata_i3: J1.13
serdes_instr_rdata_i4: J1.45
serdes_instr_rdata_i5: J1.11
serdes_instr_rdata_i6: J1.43
serdes_instr_rdata_i7: J1.9
serdes_instr_rdata_i8: J1.41
serdes_instr_rdata_i9: J1.7
serdes_instr_rdata_i10: J1.39
serdes_instr_rdata_i11: J1.5
serdes_instr_rdata_i12: J1.37
serdes_instr_rdata_i13: J1.3
serdes_instr_rdata_i14: J1.35
serdes_instr_rdata_i15: J1.1
slow_clk_i: J6.45 ; port slow_clk_i
test_en_i: J6.9 ; port test_en_i

Not connected (* = marked no-connect by the designer): J1 33 MH1 MH2 MP1 MP2; J2 33 MH1 MH2 MP1 MP2; J3 33 MH1 MH2 MP1 MP2; J4 33 MH1 MH2 MP1 MP2; J5 33 MH1 MH2 MP1 MP2; J6 33 35 MH1 MH2 MP1 MP2

### Buses and harness runs
bus data_wdata_intg_o[0..6] = port data_wdata_intg_o_[0..6]
bus irq_fast_i[0..14] = port irq_fast_i_[0..14]
bus serdes_data_addr_o[0..15] = port serdes_data_addr_o_[0..15]
bus serdes_data_be_o[0..1] = port serdes_data_be_o_[0..1]
bus serdes_data_rdata_i[0..15] = port serdes_data_rdata_i_[0..15]
bus serdes_data_wdata_o[0..15] = port serdes_data_wdata_o_[0..15]
bus serdes_instr_addr_o[0..15] = port serdes_instr_addr_o_[0..15]
bus serdes_instr_rdata_i[0..15] = port serdes_instr_rdata_i[0..15]

### Library data of the parts
J1-J6 = 785633-01: Connector; Manufacturer_Name: NI; Datasheet Link: https://www.digikey.com/en/products/detail/ni/785633-01/16637125?s=N4IgTCBcDaIOwA4CsA2AzGkBdAvkA; Height: 10.8mm; Manufacturer_Part_Number: 785633-01

## Sheet COBConnector.SchDoc
size C; SheetNumber: 2; SheetTotal: 3
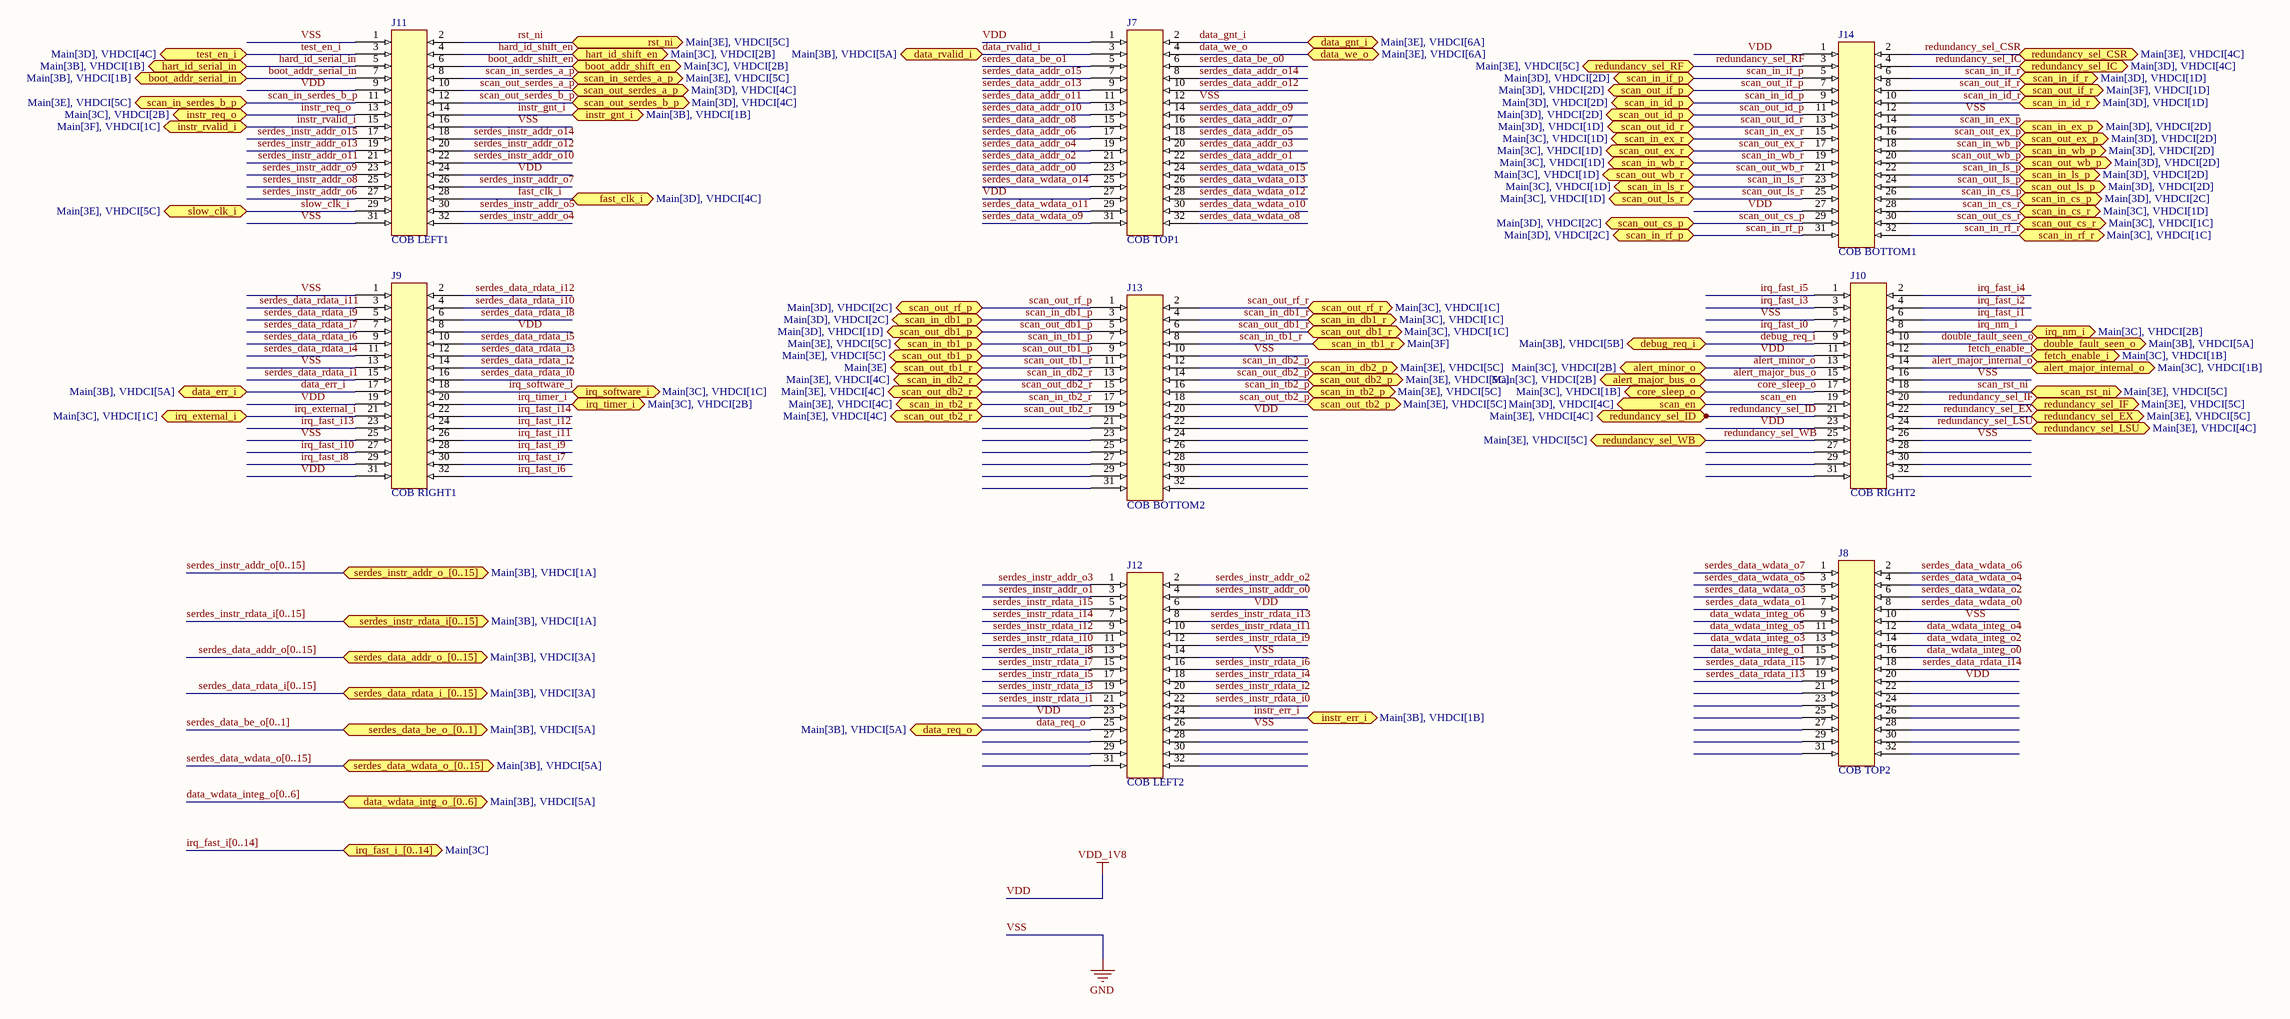
[diagram p3: COBConnector.SchDoc]

### Parts
J7  COB TOP1  [CON32_2X16_TU_BBS_SAI]
J8  COB TOP2  [CON32_2X16_TU_BBS_SAI]
J9  COB RIGHT1  [CON32_2X16_TU_BBS_SAI]
J10  COB RIGHT2  [CON32_2X16_TU_BBS_SAI]
J11  COB LEFT1  [CON32_2X16_TU_BBS_SAI]
J12  COB LEFT2  [CON32_2X16_TU_BBS_SAI]
J13  COB BOTTOM2  [CON32_2X16_TU_BBS_SAI]
J14  COB BOTTOM1  [CON32_2X16_TU_BBS_SAI]

### Ports
alert_major_bus_o (bidir, see Main[3C], VHDCI[2B]), alert_major_internal_o (bidir, see Main[3C], VHDCI[1B]), alert_minor_o (bidir, see Main[3C], VHDCI[2B]), boot_addr_serial_in (bidir, see Main[3B], VHDCI[1B]), boot_addr_shift_en (bidir, see Main[3C], VHDCI[2B]), core_sleep_o (bidir, see Main[3C], VHDCI[1B]), data_err_i (bidir, see Main[3B], VHDCI[5A]), data_gnt_i (bidir, see Main[3E], VHDCI[6A]), data_req_o (bidir, see Main[3B], VHDCI[5A]), data_rvalid_i (bidir, see Main[3B], VHDCI[5A]), data_wdata_intg_o_[0..6] (bidir, see Main[3B], VHDCI[5A]), data_we_o (bidir, see Main[3E], VHDCI[6A]), debug_req_i (bidir, see Main[3B], VHDCI[5B]), double_fault_seen_o (bidir, see Main[3B], VHDCI[5A]), fast_clk_i (bidir, see Main[3D], VHDCI[4C]), fetch_enable_i (bidir, see Main[3C], VHDCI[1B]), hart_id_serial_in (bidir, see Main[3B], VHDCI[1B]), hart_id_shift_en (bidir, see Main[3C], VHDCI[2B]), instr_err_i (bidir, see Main[3B], VHDCI[1B]), instr_gnt_i (bidir, see Main[3B], VHDCI[1B]), instr_req_o (bidir, see Main[3C], VHDCI[2B]), instr_rvalid_i (bidir, see Main[3F], VHDCI[1C]), irq_external_i (bidir, see Main[3C], VHDCI[1C]), irq_fast_i_[0..14] (bidir, see Main[3C]), irq_nm_i (bidir, see Main[3C], VHDCI[2B]), irq_software_i (bidir, see Main[3C], VHDCI[1C]), irq_timer_i (bidir, see Main[3C], VHDCI[2B]), redundancy_sel_CSR (bidir, see Main[3E], VHDCI[4C]), redundancy_sel_EX (bidir, see Main[3E], VHDCI[5C]), redundancy_sel_IC (bidir, see Main[3D], VHDCI[4C]), redundancy_sel_ID (bidir, see Main[3E], VHDCI[4C]), redundancy_sel_IF (bidir, see Main[3E], VHDCI[5C]), redundancy_sel_LSU (bidir, see Main[3E], VHDCI[4C]), redundancy_sel_RF (bidir, see Main[3E], VHDCI[5C]), redundancy_sel_WB (bidir, see Main[3E], VHDCI[5C]), rst_ni (bidir, see Main[3E], VHDCI[5C]), scan_en (bidir, see Main[3D], VHDCI[4C]), scan_in_cs_p (bidir, see Main[3D], VHDCI[2C]), scan_in_cs_r (bidir, see Main[3C], VHDCI[1D]), scan_in_db1_p (bidir, see Main[3D], VHDCI[2C]), scan_in_db1_r (bidir, see Main[3C], VHDCI[1C]), scan_in_db2_p (bidir, see Main[3E], VHDCI[5C]), scan_in_db2_r (bidir, see Main[3E], VHDCI[4C]), scan_in_ex_p (bidir, see Main[3D], VHDCI[2D]), scan_in_ex_r (bidir, see Main[3C], VHDCI[1D]), scan_in_id_p (bidir, see Main[3D], VHDCI[2D]), scan_in_id_r (bidir, see Main[3D], VHDCI[1D]), scan_in_if_p (bidir, see Main[3D], VHDCI[2D]), scan_in_if_r (bidir, see Main[3D], VHDCI[1D]), scan_in_ls_p (bidir, see Main[3D], VHDCI[2D]), scan_in_ls_r (bidir, see Main[3C], VHDCI[1D]), scan_in_rf_p (bidir, see Main[3D], VHDCI[2C]), scan_in_rf_r (bidir, see Main[3C], VHDCI[1C]), scan_in_serdes_a_p (bidir, see Main[3E], VHDCI[5C]), scan_in_serdes_b_p (bidir, see Main[3E], VHDCI[5C]), scan_in_tb1_p (bidir, see Main[3E], VHDCI[5C]), scan_in_tb1_r (bidir, see Main[3F]), scan_in_tb2_p (bidir, see Main[3E], VHDCI[5C]), scan_in_tb2_r (bidir, see Main[3E], VHDCI[4C]), scan_in_wb_p (bidir, see Main[3D], VHDCI[2D]), scan_in_wb_r (bidir, see Main[3C], VHDCI[1D]), scan_out_cs_p (bidir, see Main[3D], VHDCI[2C]), scan_out_cs_r (bidir, see Main[3C], VHDCI[1C]), scan_out_db1_p (bidir, see Main[3D], VHDCI[1D]), scan_out_db1_r (bidir, see Main[3C], VHDCI[1C]), scan_out_db2_p (bidir, see Main[3E], VHDCI[5C]), scan_out_db2_r (bidir, see Main[3E], VHDCI[4C]), scan_out_ex_p (bidir, see Main[3D], VHDCI[2D]), scan_out_ex_r (bidir, see Main[3C], VHDCI[1D]), scan_out_id_p (bidir, see Main[3D], VHDCI[2D]), scan_out_id_r (bidir, see Main[3D], VHDCI[1D]), scan_out_if_p (bidir, see Main[3D], VHDCI[2D]), scan_out_if_r (bidir, see Main[3F], VHDCI[1D]), scan_out_ls_p (bidir, see Main[3D], VHDCI[2D]), scan_out_ls_r (bidir, see Main[3C], VHDCI[1D]), scan_out_rf_p (bidir, see Main[3D], VHDCI[2C]), scan_out_rf_r (bidir, see Main[3C], VHDCI[1C]), scan_out_serdes_a_p (bidir, see Main[3D], VHDCI[4C]), scan_out_serdes_b_p (bidir, see Main[3D], VHDCI[4C]), scan_out_tb1_p (bidir, see Main[3E], VHDCI[5C]), scan_out_tb1_r (bidir, see Main[3E]), scan_out_tb2_p (bidir, see Main[3E], VHDCI[5C]), scan_out_tb2_r (bidir, see Main[3E], VHDCI[4C]), scan_out_wb_p (bidir, see Main[3D], VHDCI[2D]), scan_out_wb_r (bidir, see Main[3C], VHDCI[1D]), scan_rst_ni (bidir, see Main[3E], VHDCI[5C]), serdes_data_addr_o_[0..15] (bidir, see Main[3B], VHDCI[3A]), serdes_data_be_o_[0..1] (bidir, see Main[3B], VHDCI[5A]), serdes_data_rdata_i_[0..15] (bidir, see Main[3B], VHDCI[3A]), serdes_data_wdata_o_[0..15] (bidir, see Main[3B], VHDCI[5A]), serdes_instr_addr_o_[0..15] (bidir, see Main[3B], VHDCI[1A]), serdes_instr_rdata_i[0..15] (bidir, see Main[3B], VHDCI[1A]), slow_clk_i (bidir, see Main[3E], VHDCI[5C]), test_en_i (bidir, see Main[3D], VHDCI[4C])

### Nets
VDD: J7.1 J7.27 J8.20 J9.8 J9.19 J9.31 J10.11 J10.23 J11.9 J11.24 J12.6 J12.23 J13.20 J14.1 J14.27  [also labelled VDD_1V8]
VSS: J7.12 J8.10 J9.1 J9.13 J9.25 J10.5 J10.16 J10.26 J11.1 J11.16 J11.31 J12.14 J12.26 J13.10 J14.12  [also labelled GND]
alert_major_bus_o: J10.15 ; port alert_major_bus_o
alert_major_internal_o: J10.14 ; port alert_major_internal_o
alert_minor_o: J10.13 ; port alert_minor_o
boot_addr_serial_in: J11.7 ; port boot_addr_serial_in
boot_addr_shift_en: J11.6 ; port boot_addr_shift_en
core_sleep_o: J10.17 ; port core_sleep_o
data_err_i: J9.17 ; port data_err_i
data_gnt_i: J7.2 ; port data_gnt_i
data_req_o: J12.25 ; port data_req_o
data_rvalid_i: J7.3 ; port data_rvalid_i
data_wdata_integ_o0: J8.16
data_wdata_integ_o1: J8.15
data_wdata_integ_o2: J8.14
data_wdata_integ_o3: J8.13
data_wdata_integ_o4: J8.12
data_wdata_integ_o5: J8.11
data_wdata_integ_o6: J8.9
data_we_o: J7.4 ; port data_we_o
debug_req_i: J10.9 ; port debug_req_i
double_fault_seen_o: J10.10 ; port double_fault_seen_o
fast_clk_i: J11.28 ; port fast_clk_i
fetch_enable_i: J10.12 ; port fetch_enable_i
hard_id_serial_in: J11.5 ; port hart_id_serial_in
hard_id_shift_en: J11.4 ; port hart_id_shift_en
instr_err_i: J12.24 ; port instr_err_i
instr_gnt_i: J11.14 ; port instr_gnt_i
instr_req_o: J11.13 ; port instr_req_o
instr_rvalid_i: J11.15 ; port instr_rvalid_i
irq_external_i: J9.21 ; port irq_external_i
irq_fast_i0: J10.7
irq_fast_i1: J10.6
irq_fast_i2: J10.4
irq_fast_i3: J10.3
irq_fast_i4: J10.2
irq_fast_i5: J10.1
irq_fast_i6: J9.32
irq_fast_i7: J9.30
irq_fast_i8: J9.29
irq_fast_i9: J9.28
irq_fast_i10: J9.27
irq_fast_i11: J9.26
irq_fast_i12: J9.24
irq_fast_i13: J9.23
irq_fast_i14: J9.22
irq_nm_i: J10.8 ; port irq_nm_i
irq_software_i: J9.18 ; port irq_software_i
irq_timer_i: J9.20 ; port irq_timer_i
redundancy_sel_CSR: J14.2 ; port redundancy_sel_CSR
redundancy_sel_EX: J10.22 ; port redundancy_sel_EX
redundancy_sel_IC: J14.4 ; port redundancy_sel_IC
redundancy_sel_ID: J10.21 ; port redundancy_sel_ID
redundancy_sel_IF: J10.20 ; port redundancy_sel_IF
redundancy_sel_LSU: J10.24 ; port redundancy_sel_LSU
redundancy_sel_RF: J14.3 ; port redundancy_sel_RF
redundancy_sel_WB: J10.25 ; port redundancy_sel_WB
rst_ni: J11.2 ; port rst_ni
scan_en: J10.19 ; port scan_en
scan_in_cs_p: J14.26 ; port scan_in_cs_p
scan_in_cs_r: J14.28 ; port scan_in_cs_r
scan_in_db1_p: J13.3 ; port scan_in_db1_p
scan_in_db1_r: J13.4 ; port scan_in_db1_r
scan_in_db2_p: J13.12 ; port scan_in_db2_p
scan_in_db2_r: J13.13 ; port scan_in_db2_r
scan_in_ex_p: J14.14 ; port scan_in_ex_p
scan_in_ex_r: J14.15 ; port scan_in_ex_r
scan_in_id_p: J14.9 ; port scan_in_id_p
scan_in_id_r: J14.10 ; port scan_in_id_r
scan_in_if_p: J14.5 ; port scan_in_if_p
scan_in_if_r: J14.6 ; port scan_in_if_r
scan_in_ls_p: J14.22 ; port scan_in_ls_p
scan_in_ls_r: J14.23 ; port scan_in_ls_r
scan_in_rf_p: J14.31 ; port scan_in_rf_p
scan_in_rf_r: J14.32 ; port scan_in_rf_r
scan_in_serdes_a_p: J11.8 ; port scan_in_serdes_a_p
scan_in_serdes_b_p: J11.11 ; port scan_in_serdes_b_p
scan_in_tb1_p: J13.7 ; port scan_in_tb1_p
scan_in_tb1_r: J13.8 ; port scan_in_tb1_r
scan_in_tb2_p: J13.16 ; port scan_in_tb2_p
scan_in_tb2_r: J13.17 ; port scan_in_tb2_r
scan_in_wb_p: J14.18 ; port scan_in_wb_p
scan_in_wb_r: J14.19 ; port scan_in_wb_r
scan_out_cs_p: J14.29 ; port scan_out_cs_p
scan_out_cs_r: J14.30 ; port scan_out_cs_r
scan_out_db1_p: J13.5 ; port scan_out_db1_p
scan_out_db1_r: J13.6 ; port scan_out_db1_r
scan_out_db2_p: J13.14 ; port scan_out_db2_p
scan_out_db2_r: J13.15 ; port scan_out_db2_r
scan_out_ex_p: J14.16 ; port scan_out_ex_p
scan_out_ex_r: J14.17 ; port scan_out_ex_r
scan_out_id_p: J14.11 ; port scan_out_id_p
scan_out_id_r: J14.13 ; port scan_out_id_r
scan_out_if_p: J14.7 ; port scan_out_if_p
scan_out_if_r: J14.8 ; port scan_out_if_r
scan_out_ls_p: J14.24 ; port scan_out_ls_p
scan_out_ls_r: J14.25 ; port scan_out_ls_r
scan_out_rf_p: J13.1 ; port scan_out_rf_p
scan_out_rf_r: J13.2 ; port scan_out_rf_r
scan_out_serdes_a_p: J11.10 ; port scan_out_serdes_a_p
scan_out_serdes_b_p: J11.12 ; port scan_out_serdes_b_p
scan_out_tb1_p: J13.9 ; port scan_out_tb1_p
scan_out_tb1_r: J13.11 ; port scan_out_tb1_r  [project net scan_in_tb1_r]
scan_out_tb2_p: J13.18 ; port scan_out_tb2_p
scan_out_tb2_r: J13.19 ; port scan_out_tb2_r
scan_out_wb_p: J14.20 ; port scan_out_wb_p
scan_out_wb_r: J14.21 ; port scan_out_wb_r
scan_rst_ni: J10.18 ; port scan_rst_ni
serdes_data_addr_o0: J7.23
serdes_data_addr_o1: J7.22
serdes_data_addr_o2: J7.21
serdes_data_addr_o3: J7.20
serdes_data_addr_o4: J7.19
serdes_data_addr_o5: J7.18
serdes_data_addr_o6: J7.17
serdes_data_addr_o7: J7.16
serdes_data_addr_o8: J7.15
serdes_data_addr_o9: J7.14
serdes_data_addr_o10: J7.13
serdes_data_addr_o11: J7.11
serdes_data_addr_o12: J7.10
serdes_data_addr_o13: J7.9
serdes_data_addr_o14: J7.8
serdes_data_addr_o15: J7.7
serdes_data_be_o0: J7.6
serdes_data_be_o1: J7.5
serdes_data_rdata_i0: J9.16
serdes_data_rdata_i1: J9.15
serdes_data_rdata_i2: J9.14
serdes_data_rdata_i3: J9.12
serdes_data_rdata_i4: J9.11
serdes_data_rdata_i5: J9.10
serdes_data_rdata_i6: J9.9
serdes_data_rdata_i7: J9.7
serdes_data_rdata_i8: J9.6
serdes_data_rdata_i9: J9.5
serdes_data_rdata_i10: J9.4
serdes_data_rdata_i11: J9.3
serdes_data_rdata_i12: J9.2
serdes_data_rdata_i13: J8.19
serdes_data_rdata_i14: J8.18
serdes_data_rdata_i15: J8.17
serdes_data_wdata_o0: J8.8
serdes_data_wdata_o1: J8.7
serdes_data_wdata_o2: J8.6
serdes_data_wdata_o3: J8.5
serdes_data_wdata_o4: J8.4
serdes_data_wdata_o5: J8.3
serdes_data_wdata_o6: J8.2
serdes_data_wdata_o7: J8.1
serdes_data_wdata_o8: J7.32
serdes_data_wdata_o9: J7.31
serdes_data_wdata_o10: J7.30
serdes_data_wdata_o11: J7.29
serdes_data_wdata_o12: J7.28
serdes_data_wdata_o13: J7.26
serdes_data_wdata_o14: J7.25
serdes_data_wdata_o15: J7.24
serdes_instr_addr_o0: J12.4
serdes_instr_addr_o1: J12.3
serdes_instr_addr_o2: J12.2
serdes_instr_addr_o3: J12.1
serdes_instr_addr_o4: J11.32
serdes_instr_addr_o5: J11.30
serdes_instr_addr_o6: J11.27
serdes_instr_addr_o7: J11.26
serdes_instr_addr_o8: J11.25
serdes_instr_addr_o9: J11.23
serdes_instr_addr_o10: J11.22
serdes_instr_addr_o11: J11.21
serdes_instr_addr_o12: J11.20
serdes_instr_addr_o13: J11.19
serdes_instr_addr_o14: J11.18
serdes_instr_addr_o15: J11.17
serdes_instr_rdata_i0: J12.22
serdes_instr_rdata_i1: J12.21
serdes_instr_rdata_i2: J12.20
serdes_instr_rdata_i3: J12.19
serdes_instr_rdata_i4: J12.18
serdes_instr_rdata_i5: J12.17
serdes_instr_rdata_i6: J12.16
serdes_instr_rdata_i7: J12.15
serdes_instr_rdata_i8: J12.13
serdes_instr_rdata_i9: J12.12
serdes_instr_rdata_i10: J12.11
serdes_instr_rdata_i11: J12.10
serdes_instr_rdata_i12: J12.9
serdes_instr_rdata_i13: J12.8
serdes_instr_rdata_i14: J12.7
serdes_instr_rdata_i15: J12.5
slow_clk_i: J11.29 ; port slow_clk_i
test_en_i: J11.3 ; port test_en_i

Not connected (* = marked no-connect by the designer): J8 21 22 23 24 25 26 27 28 29 30 31 32; J10 27 28 29 30 31 32; J12 27 28 29 30 31 32; J13 21 22 23 24 25 26 27 28 29 30 31 32

### Buses and harness runs
bus data_wdata_integ_o[0..6] = port data_wdata_intg_o_[0..6]
bus irq_fast_i[0..14] = port irq_fast_i_[0..14]
bus serdes_data_addr_o[0..15] = port serdes_data_addr_o_[0..15]
bus serdes_data_be_o[0..1] = port serdes_data_be_o_[0..1]
bus serdes_data_rdata_i[0..15] = port serdes_data_rdata_i_[0..15]
bus serdes_data_wdata_o[0..15] = port serdes_data_wdata_o_[0..15]
bus serdes_instr_addr_o[0..15] = port serdes_instr_addr_o_[0..15]
bus serdes_instr_rdata_i[0..15] = port serdes_instr_rdata_i[0..15]

### Library data of the parts
J7-J14 = BBD-116-G-A

## Nets that join several sheets
VSS: VHDCI (186 pins), COBConnector (15 pins)
alert_major_bus_o: VHDCI (J4.43), COBConnector (J10.15)
alert_major_internal_o: VHDCI (J4.11), COBConnector (J10.14)
alert_minor_o: VHDCI (J4.45), COBConnector (J10.13)
boot_addr_serial_in: VHDCI (J4.5), COBConnector (J11.7)
boot_addr_shift_en: VHDCI (J4.39), COBConnector (J11.6)
core_sleep_o: VHDCI (J4.9), COBConnector (J10.17)
data_err_i: VHDCI (J3.3), COBConnector (J9.17)
data_gnt_i: VHDCI (J3.39), COBConnector (J7.2)
data_req_o: VHDCI (J3.7), COBConnector (J12.25)
data_rvalid_i: VHDCI (J3.5), COBConnector (J7.3)
data_wdata_integ_o0: VHDCI (J3.49), COBConnector (J8.16)
data_wdata_integ_o1: VHDCI (J3.15), COBConnector (J8.15)
data_wdata_integ_o2: VHDCI (J3.47), COBConnector (J8.14)
data_wdata_integ_o3: VHDCI (J3.13), COBConnector (J8.13)
data_wdata_integ_o4: VHDCI (J3.45), COBConnector (J8.12)
data_wdata_integ_o5: VHDCI (J3.11), COBConnector (J8.11)
data_wdata_integ_o6: VHDCI (J3.43), COBConnector (J8.9)
data_we_o: VHDCI (J3.37), COBConnector (J7.4)
debug_req_i: VHDCI (J3.35), COBConnector (J10.9)
double_fault_seen_o: VHDCI (J3.1), COBConnector (J10.10)
fast_clk_i: VHDCI (J6.11), COBConnector (J11.28)
fetch_enable_i: VHDCI (J4.13), COBConnector (J10.12)
hard_id_serial_in: VHDCI (J4.7), COBConnector (J11.5)
hard_id_shift_en: VHDCI (J4.41), COBConnector (J11.4)
instr_err_i: VHDCI (J4.1), COBConnector (J12.24)
instr_gnt_i: VHDCI (J4.3), COBConnector (J11.14)
instr_req_o: VHDCI (J4.37), COBConnector (J11.13)
instr_rvalid_i: VHDCI (J4.35), COBConnector (J11.15)
irq_external_i: VHDCI (J4.15), COBConnector (J9.21)
irq_fast_i0: VHDCI (J4.65), COBConnector (J10.7)
irq_fast_i1: VHDCI (J4.31), COBConnector (J10.6)
irq_fast_i2: VHDCI (J4.63), COBConnector (J10.4)
irq_fast_i3: VHDCI (J4.29), COBConnector (J10.3)
irq_fast_i4: VHDCI (J4.61), COBConnector (J10.2)
irq_fast_i5: VHDCI (J4.27), COBConnector (J10.1)
irq_fast_i6: VHDCI (J4.59), COBConnector (J9.32)
irq_fast_i7: VHDCI (J4.25), COBConnector (J9.30)
irq_fast_i8: VHDCI (J4.57), COBConnector (J9.29)
irq_fast_i9: VHDCI (J4.23), COBConnector (J9.28)
irq_fast_i10: VHDCI (J4.55), COBConnector (J9.27)
irq_fast_i11: VHDCI (J4.21), COBConnector (J9.26)
irq_fast_i12: VHDCI (J4.53), COBConnector (J9.24)
irq_fast_i13: VHDCI (J4.19), COBConnector (J9.23)
irq_fast_i14: VHDCI (J4.51), COBConnector (J9.22)
irq_nm_i: VHDCI (J4.47), COBConnector (J10.8)
irq_software_i: VHDCI (J4.17), COBConnector (J9.18)
irq_timer_i: VHDCI (J4.49), COBConnector (J9.20)
redundancy_sel_CSR: VHDCI (J6.15), COBConnector (J14.2)
redundancy_sel_EX: VHDCI (J6.51), COBConnector (J10.22)
redundancy_sel_IC: VHDCI (J6.13), COBConnector (J14.4)
redundancy_sel_ID: VHDCI (J6.19), COBConnector (J10.21)
redundancy_sel_IF: VHDCI (J6.53), COBConnector (J10.20)
redundancy_sel_LSU: VHDCI (J6.17), COBConnector (J10.24)
redundancy_sel_RF: VHDCI (J6.47), COBConnector (J14.3)
redundancy_sel_WB: VHDCI (J6.49), COBConnector (J10.25)
rst_ni: VHDCI (J6.43), COBConnector (J11.2)
scan_en: VHDCI (J6.3), COBConnector (J10.19)
scan_in_cs_p: VHDCI (J5.45), COBConnector (J14.26)
scan_in_cs_r: VHDCI (J5.11), COBConnector (J14.28)
scan_in_db1_p: VHDCI (J5.37), COBConnector (J13.3)
scan_in_db1_r: VHDCI (J5.3), COBConnector (J13.4)
scan_in_db2_p: VHDCI (J6.61), COBConnector (J13.12)
scan_in_db2_r: VHDCI (J6.27), COBConnector (J13.13)
scan_in_ex_p: VHDCI (J5.57), COBConnector (J14.14)
scan_in_ex_r: VHDCI (J5.23), COBConnector (J14.15)
scan_in_id_p: VHDCI (J5.61), COBConnector (J14.9)
scan_in_id_r: VHDCI (J5.27), COBConnector (J14.10)
scan_in_if_p: VHDCI (J5.65), COBConnector (J14.5)
scan_in_if_r: VHDCI (J5.31), COBConnector (J14.6)
scan_in_ls_p: VHDCI (J5.49), COBConnector (J14.22)
scan_in_ls_r: VHDCI (J5.15), COBConnector (J14.23)
scan_in_rf_p: VHDCI (J5.41), COBConnector (J14.31)
scan_in_rf_r: VHDCI (J5.7), COBConnector (J14.32)
scan_in_serdes_a_p: VHDCI (J6.41), COBConnector (J11.8)
scan_in_serdes_b_p: VHDCI (J6.39), COBConnector (J11.11)
scan_in_tb1_p: VHDCI (J6.65), COBConnector (J13.7)
scan_in_tb1_r: VHDCI (J6.29), COBConnector (J13.8)
scan_in_tb1_r: VHDCI (J6.31), COBConnector (J13.11)
scan_in_tb2_p: VHDCI (J6.57), COBConnector (J13.16)
scan_in_tb2_r: VHDCI (J6.23), COBConnector (J13.17)
scan_in_wb_p: VHDCI (J5.53), COBConnector (J14.18)
scan_in_wb_r: VHDCI (J5.19), COBConnector (J14.19)
scan_out_cs_p: VHDCI (J5.43), COBConnector (J14.29)
scan_out_cs_r: VHDCI (J5.9), COBConnector (J14.30)
scan_out_db1_p: VHDCI (J5.35), COBConnector (J13.5)
scan_out_db1_r: VHDCI (J5.1), COBConnector (J13.6)
scan_out_db2_p: VHDCI (J6.59), COBConnector (J13.14)
scan_out_db2_r: VHDCI (J6.25), COBConnector (J13.15)
scan_out_ex_p: VHDCI (J5.55), COBConnector (J14.16)
scan_out_ex_r: VHDCI (J5.21), COBConnector (J14.17)
scan_out_id_p: VHDCI (J5.59), COBConnector (J14.11)
scan_out_id_r: VHDCI (J5.25), COBConnector (J14.13)
scan_out_if_p: VHDCI (J5.63), COBConnector (J14.7)
scan_out_if_r: VHDCI (J5.29), COBConnector (J14.8)
scan_out_ls_p: VHDCI (J5.47), COBConnector (J14.24)
scan_out_ls_r: VHDCI (J5.13), COBConnector (J14.25)
scan_out_rf_p: VHDCI (J5.39), COBConnector (J13.1)
scan_out_rf_r: VHDCI (J5.5), COBConnector (J13.2)
scan_out_serdes_a_p: VHDCI (J6.7), COBConnector (J11.10)
scan_out_serdes_b_p: VHDCI (J6.5), COBConnector (J11.12)
scan_out_tb1_p: VHDCI (J6.63), COBConnector (J13.9)
scan_out_tb2_p: VHDCI (J6.55), COBConnector (J13.18)
scan_out_tb2_r: VHDCI (J6.21), COBConnector (J13.19)
scan_out_wb_p: VHDCI (J5.51), COBConnector (J14.20)
scan_out_wb_r: VHDCI (J5.17), COBConnector (J14.21)
scan_rst_ni: VHDCI (J6.37), COBConnector (J10.18)
serdes_data_addr_o0: VHDCI (J2.65), COBConnector (J7.23)
serdes_data_addr_o1: VHDCI (J2.31), COBConnector (J7.22)
serdes_data_addr_o2: VHDCI (J2.63), COBConnector (J7.21)
serdes_data_addr_o3: VHDCI (J2.29), COBConnector (J7.20)
serdes_data_addr_o4: VHDCI (J2.61), COBConnector (J7.19)
serdes_data_addr_o5: VHDCI (J2.27), COBConnector (J7.18)
serdes_data_addr_o6: VHDCI (J2.59), COBConnector (J7.17)
serdes_data_addr_o7: VHDCI (J2.25), COBConnector (J7.16)
serdes_data_addr_o8: VHDCI (J2.57), COBConnector (J7.15)
serdes_data_addr_o9: VHDCI (J2.23), COBConnector (J7.14)
serdes_data_addr_o10: VHDCI (J2.55), COBConnector (J7.13)
serdes_data_addr_o11: VHDCI (J2.21), COBConnector (J7.11)
serdes_data_addr_o12: VHDCI (J2.53), COBConnector (J7.10)
serdes_data_addr_o13: VHDCI (J2.19), COBConnector (J7.9)
serdes_data_addr_o14: VHDCI (J2.51), COBConnector (J7.8)
serdes_data_addr_o15: VHDCI (J2.17), COBConnector (J7.7)
serdes_data_be_o0: VHDCI (J3.9), COBConnector (J7.6)
serdes_data_be_o1: VHDCI (J3.41), COBConnector (J7.5)
serdes_data_rdata_i0: VHDCI (J2.49), COBConnector (J9.16)
serdes_data_rdata_i1: VHDCI (J2.15), COBConnector (J9.15)
serdes_data_rdata_i2: VHDCI (J2.47), COBConnector (J9.14)
serdes_data_rdata_i3: VHDCI (J2.13), COBConnector (J9.12)
serdes_data_rdata_i4: VHDCI (J2.45), COBConnector (J9.11)
serdes_data_rdata_i5: VHDCI (J2.11), COBConnector (J9.10)
serdes_data_rdata_i6: VHDCI (J2.43), COBConnector (J9.9)
serdes_data_rdata_i7: VHDCI (J2.9), COBConnector (J9.7)
serdes_data_rdata_i8: VHDCI (J2.41), COBConnector (J9.6)
serdes_data_rdata_i9: VHDCI (J2.7), COBConnector (J9.5)
serdes_data_rdata_i10: VHDCI (J2.39), COBConnector (J9.4)
serdes_data_rdata_i11: VHDCI (J2.5), COBConnector (J9.3)
serdes_data_rdata_i12: VHDCI (J2.37), COBConnector (J9.2)
serdes_data_rdata_i13: VHDCI (J2.3), COBConnector (J8.19)
serdes_data_rdata_i14: VHDCI (J2.35), COBConnector (J8.18)
serdes_data_rdata_i15: VHDCI (J2.1), COBConnector (J8.17)
serdes_data_wdata_o0: VHDCI (J3.65), COBConnector (J8.8)
serdes_data_wdata_o1: VHDCI (J3.31), COBConnector (J8.7)
serdes_data_wdata_o2: VHDCI (J3.63), COBConnector (J8.6)
serdes_data_wdata_o3: VHDCI (J3.29), COBConnector (J8.5)
serdes_data_wdata_o4: VHDCI (J3.61), COBConnector (J8.4)
serdes_data_wdata_o5: VHDCI (J3.27), COBConnector (J8.3)
serdes_data_wdata_o6: VHDCI (J3.59), COBConnector (J8.2)
serdes_data_wdata_o7: VHDCI (J3.25), COBConnector (J8.1)
serdes_data_wdata_o8: VHDCI (J3.57), COBConnector (J7.32)
serdes_data_wdata_o9: VHDCI (J3.23), COBConnector (J7.31)
serdes_data_wdata_o10: VHDCI (J3.55), COBConnector (J7.30)
serdes_data_wdata_o11: VHDCI (J3.21), COBConnector (J7.29)
serdes_data_wdata_o12: VHDCI (J3.53), COBConnector (J7.28)
serdes_data_wdata_o13: VHDCI (J3.19), COBConnector (J7.26)
serdes_data_wdata_o14: VHDCI (J3.51), COBConnector (J7.25)
serdes_data_wdata_o15: VHDCI (J3.17), COBConnector (J7.24)
serdes_instr_addr_o0: VHDCI (J1.65), COBConnector (J12.4)
serdes_instr_addr_o1: VHDCI (J1.31), COBConnector (J12.3)
serdes_instr_addr_o2: VHDCI (J1.63), COBConnector (J12.2)
serdes_instr_addr_o3: VHDCI (J1.29), COBConnector (J12.1)
serdes_instr_addr_o4: VHDCI (J1.61), COBConnector (J11.32)
serdes_instr_addr_o5: VHDCI (J1.27), COBConnector (J11.30)
serdes_instr_addr_o6: VHDCI (J1.59), COBConnector (J11.27)
serdes_instr_addr_o7: VHDCI (J1.25), COBConnector (J11.26)
serdes_instr_addr_o8: VHDCI (J1.57), COBConnector (J11.25)
serdes_instr_addr_o9: VHDCI (J1.23), COBConnector (J11.23)
serdes_instr_addr_o10: VHDCI (J1.55), COBConnector (J11.22)
serdes_instr_addr_o11: VHDCI (J1.21), COBConnector (J11.21)
serdes_instr_addr_o12: VHDCI (J1.53), COBConnector (J11.20)
serdes_instr_addr_o13: VHDCI (J1.19), COBConnector (J11.19)
serdes_instr_addr_o14: VHDCI (J1.51), COBConnector (J11.18)
serdes_instr_addr_o15: VHDCI (J1.17), COBConnector (J11.17)
serdes_instr_rdata_i0: VHDCI (J1.49), COBConnector (J12.22)
serdes_instr_rdata_i1: VHDCI (J1.15), COBConnector (J12.21)
serdes_instr_rdata_i2: VHDCI (J1.47), COBConnector (J12.20)
serdes_instr_rdata_i3: VHDCI (J1.13), COBConnector (J12.19)
serdes_instr_rdata_i4: VHDCI (J1.45), COBConnector (J12.18)
serdes_instr_rdata_i5: VHDCI (J1.11), COBConnector (J12.17)
serdes_instr_rdata_i6: VHDCI (J1.43), COBConnector (J12.16)
serdes_instr_rdata_i7: VHDCI (J1.9), COBConnector (J12.15)
serdes_instr_rdata_i8: VHDCI (J1.41), COBConnector (J12.13)
serdes_instr_rdata_i9: VHDCI (J1.7), COBConnector (J12.12)
serdes_instr_rdata_i10: VHDCI (J1.39), COBConnector (J12.11)
serdes_instr_rdata_i11: VHDCI (J1.5), COBConnector (J12.10)
serdes_instr_rdata_i12: VHDCI (J1.37), COBConnector (J12.9)
serdes_instr_rdata_i13: VHDCI (J1.3), COBConnector (J12.8)
serdes_instr_rdata_i14: VHDCI (J1.35), COBConnector (J12.7)
serdes_instr_rdata_i15: VHDCI (J1.1), COBConnector (J12.5)
slow_clk_i: VHDCI (J6.45), COBConnector (J11.29)
test_en_i: VHDCI (J6.9), COBConnector (J11.3)